# Altium project R01L_F.PrjPCB (part 3 of 3)

## Sheet 52_MIPI_Panel.SchDoc: R01L_F
size A3; DocumentNumber: Kang jin; Revision: 1.0; SheetNumber: 18; SheetTotal: 23
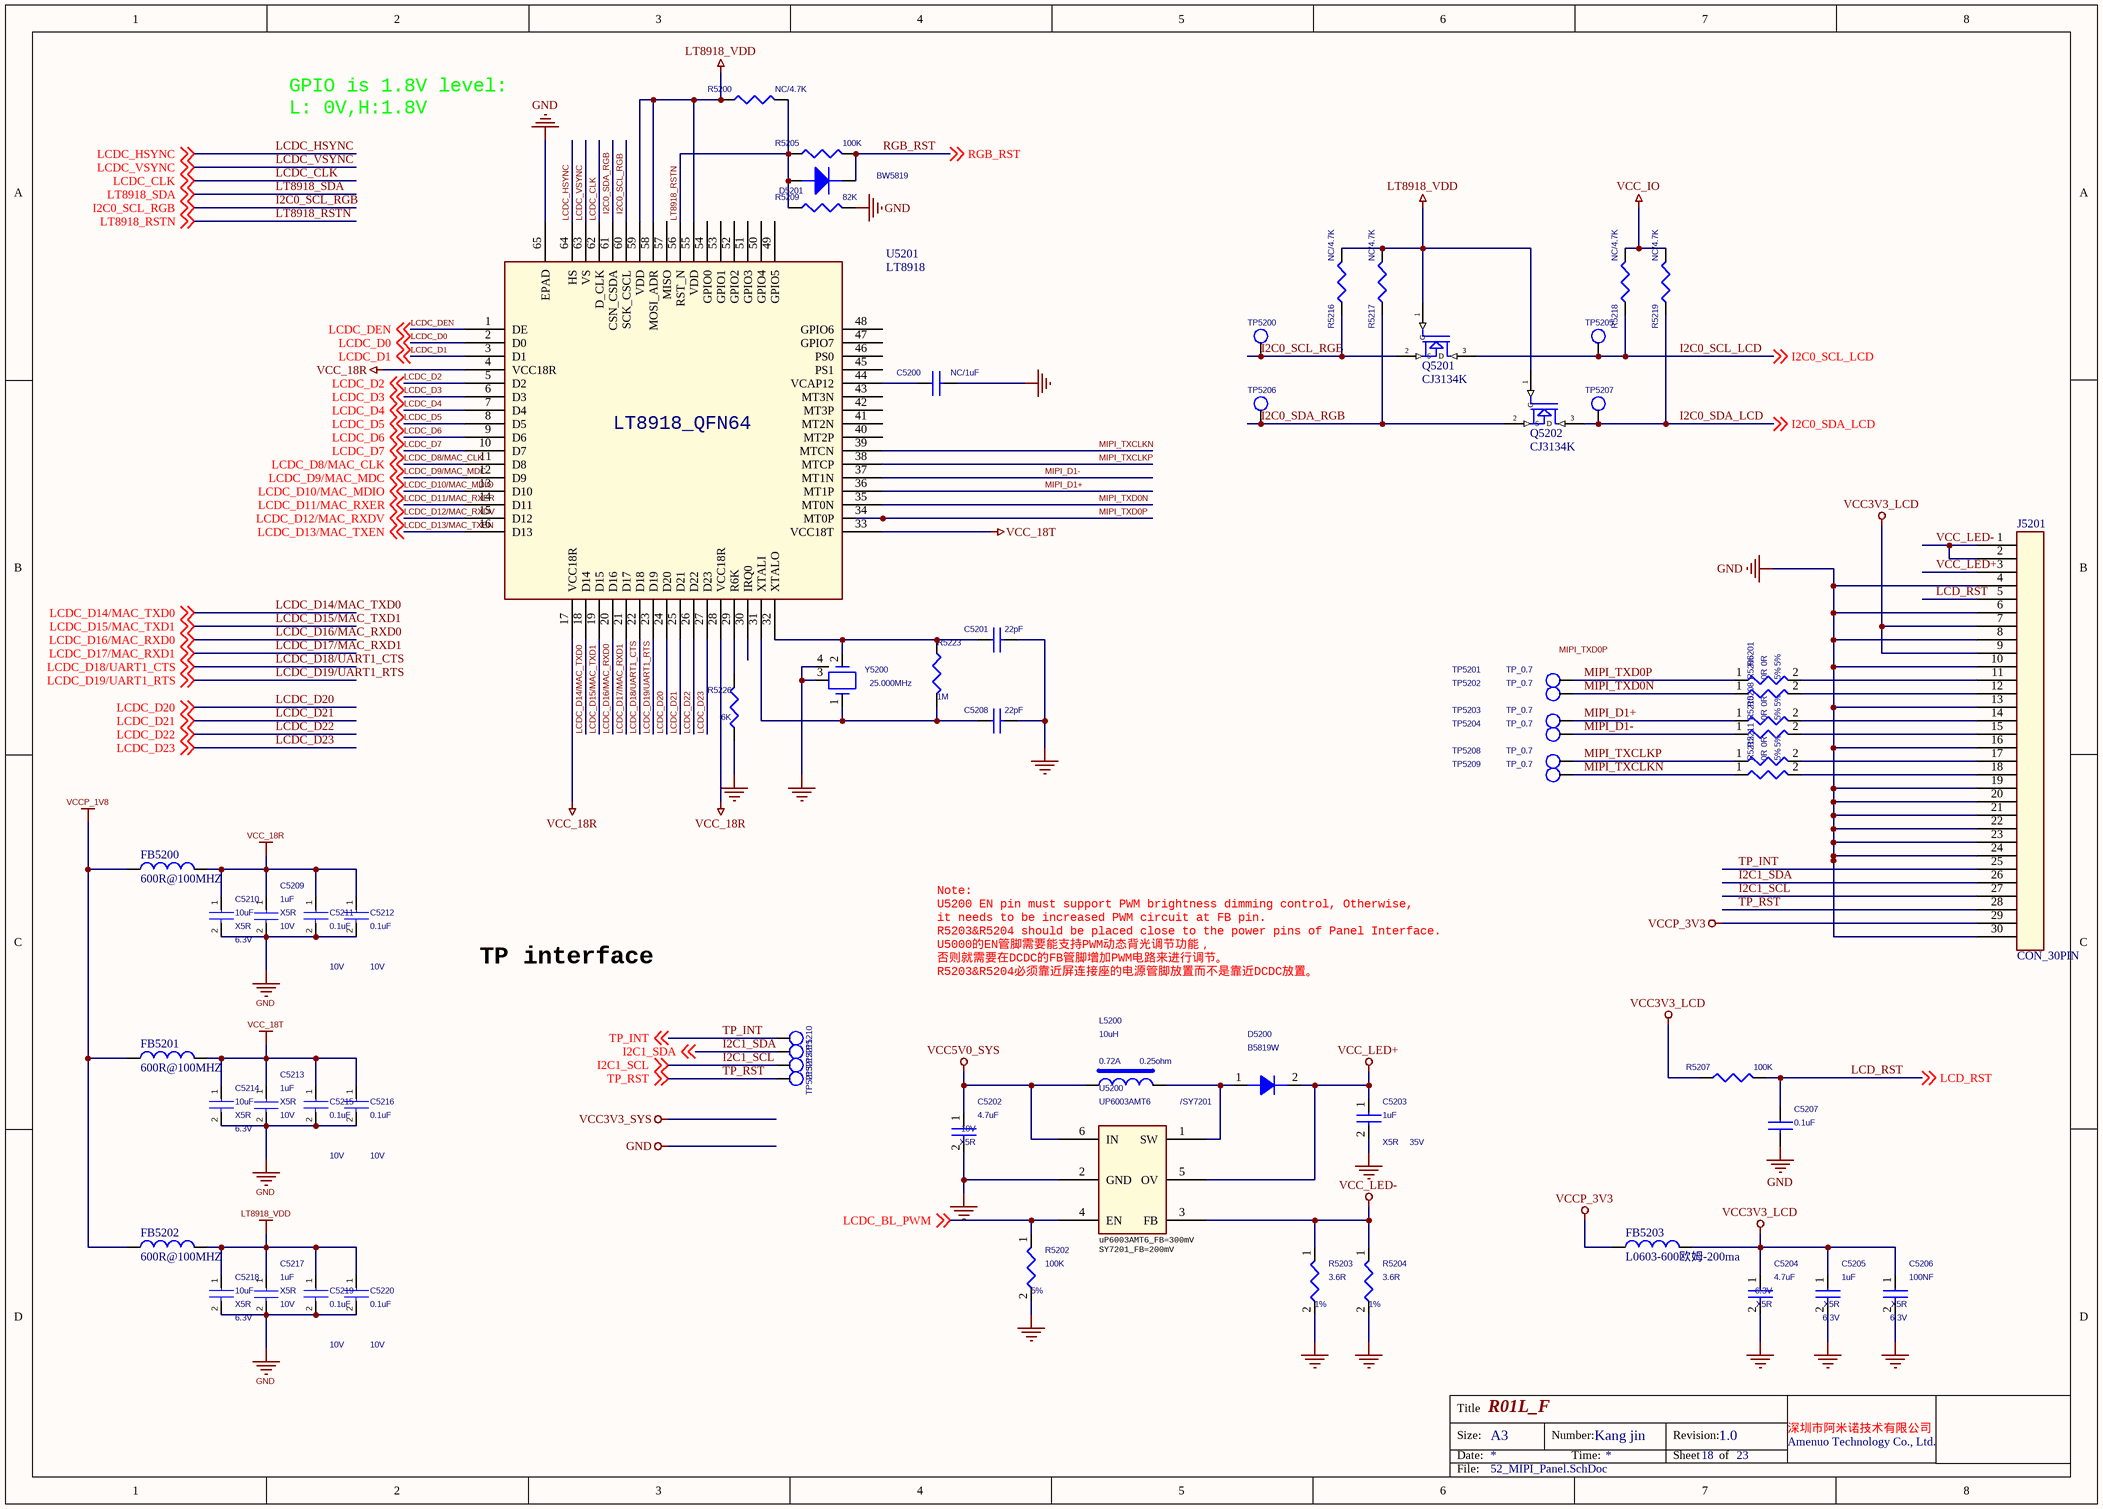
[diagram p29: 52_MIPI_Panel.SchDoc]

### Parts
C5200  NC/1uF  [C0402]
C5201  22pF  [C0402]
C5202  4.7uF  Voltage: 10V  Dielectric: X5R  [C0603]
C5203  1uF  Voltage: 35V  Dielectric: X5R  [C0402]
C5204  4.7uF  Voltage: 6.3V  Dielectric: X5R  [C0402]
C5205  1uF  Voltage: 6.3V  Dielectric: X5R  [C0402]
C5206  100NF  Voltage: 6.3V  Dielectric: X5R  [C0402]
C5207  0.1uF  [C0402]
C5208  22pF  [C0402]
C5209  value 1uF  Voltage: 10V  Dielectric: X5R  [C0402]  (hidden comment: CAP_NP_2)
C5210  value 10uF  Dielectric: X5R  Voltage: 6.3V  [C0603]  (hidden comment: CAP_NP_2)
C5211  value 0.1uF  Voltage: 10V  [C0402]  (hidden comment: CAP_NP_2)
C5212  value 0.1uF  Voltage: 10V  [C0402]  (hidden comment: CAP_NP_2)
C5213  value 1uF  Voltage: 10V  Dielectric: X5R  [C0402]  (hidden comment: CAP_NP_2)
C5214  value 10uF  Dielectric: X5R  Voltage: 6.3V  [C0603]  (hidden comment: CAP_NP_2)
C5215  value 0.1uF  Voltage: 10V  [C0402]  (hidden comment: CAP_NP_2)
C5216  value 0.1uF  Voltage: 10V  [C0402]  (hidden comment: CAP_NP_2)
C5217  value 1uF  Voltage: 10V  Dielectric: X5R  [C0402]  (hidden comment: CAP_NP_2)
C5218  value 10uF  Dielectric: X5R  Voltage: 6.3V  [C0603]  (hidden comment: CAP_NP_2)
C5219  value 0.1uF  Voltage: 10V  [C0402]  (hidden comment: CAP_NP_2)
C5220  value 0.1uF  Voltage: 10V  [C0402]  (hidden comment: CAP_NP_2)
D5200  B5819W  [SOD123]
D5201  BW5819  [SOD-323]
FB5200  600R@100MHZ  [L0402]
FB5201  600R@100MHZ  [L0402]
FB5202  600R@100MHZ  [L0402]
FB5203  L0603-600欧姆-200ma  [L0402]
J5201  CON_30PIN  [X05A10H30G]
L5200  10uH  DC Resistor: 0.25ohm  Isat: 0.72A  [IND-3X3]
Q5201  CJ3134K  [SOT23]
Q5202  CJ3134K  [SOT23]
R5200  NC/4.7K  [R0402]
R5201  0R  Tolerance: 5%  [R0402]
R5202  100K  Tolerance: 5%  [R0402]
R5203  3.6R  Tolerance: 1%  [R0402]
R5204  3.6R  Tolerance: 1%  [R0402]
R5205  100K  [R0402]
R5206  0R  Tolerance: 5%  [R0402]
R5207  100K  [R0402]
R5208  0R  Tolerance: 5%  [R0402]
R5209  82K  [R0402]
R5210  0R  Tolerance: 5%  [R0402]
R5211  0R  Tolerance: 5%  [R0402]
R5212  0R  Tolerance: 5%  [R0402]
R5216  NC/4.7K  [R0402]
R5217  NC/4.7K  [R0402]
R5218  NC/4.7K  [R0402]
R5219  NC/4.7K  [R0402]
R5223  1M  [R0402]
R5226  6K  [R0402]
TP5200  TP_0.7  [TEST]  (value not drawn)
TP5201  TP_0.7  [TP]
TP5202  TP_0.7  [TP]
TP5203  TP_0.7  [TP]
TP5204  TP_0.7  [TP]
TP5205  TP_0.7  [TEST]  (value not drawn)
TP5206  TP_0.7  [TEST]  (value not drawn)
TP5207  TP_0.7  [TEST]  (value not drawn)
TP5208  TP_0.7  [TP]
TP5209  TP_0.7  [TP]
TP5210  TP_0.7  [TEST]  (value not drawn)
TP5211  TP_0.7  [TEST]  (value not drawn)
TP5212  TP_0.7  [TEST]  (value not drawn)
TP5213  TP_0.7  [TEST]  (value not drawn)
U5200  UP6003AMT6  Option: /SY7201  [SOT-23-6]
U5201  LT8918  [LT8918_QFN64_EPAD]
Y5200  25.000MHz  [SMD_3225]

### Nets
GND: C5200.2 C5201.2 C5202.2 C5203.2 C5204.2 C5205.2 C5206.2 C5207.2 C5208.2 C5209.2 C5210.2 C5211.2 C5212.2 C5213.2 C5214.2 C5215.2 C5216.2 C5217.2 C5218.2 C5219.2 C5220.2 J5201.4 J5201.6 J5201.8 J5201.10 J5201.13 J5201.16 J5201.19 J5201.20 J5201.21 J5201.22 J5201.23 J5201.24 J5201.30 R5202.2 R5203.2 R5204.2 R5209.2 R5226.1 U5200.2(GND) U5201.65(EPAD) Y5200.3 Y5200.4
LT8918_VDD: C5217.1 C5218.1 C5219.1 C5220.1 FB5202.2 Q5201.1(G) Q5202.1(G) R5200.1 R5216.2 R5217.2 U5201.55(VDD) U5201.58(MOSI_ADR) U5201.59(VDD)
VCC3V3_LCD: C5204.1 C5205.1 C5206.1 FB5203.2 J5201.7 J5201.9 R5207.1
VCC5V0_SYS: C5202.1 L5200.1 U5200.6(IN)
VCC_18R: C5209.1 C5210.1 C5211.1 C5212.1 FB5200.2 U5201.4(VCC18R) U5201.17(VCC18R) U5201.28(VCC18R)
VCC_18T: C5213.1 C5214.1 C5215.1 C5216.1 FB5201.2 U5201.33(VCC18T)
VCC_IO: R5218.2 R5219.2
VCC_LED+: C5203.1 D5200.2(K) J5201.3 U5200.5(OV)
VCC_LED-: J5201.1 J5201.2 R5203.1 R5204.1 U5200.3(FB)
VCCP_1V8: FB5200.1 FB5201.1 FB5202.1
VCCP_3V3: FB5203.1 J5201.29
I2C0_SCL_LCD: Q5201.3(D) R5218.1 TP5205.1 ; off-sheet I2C0_SCL_LCD
I2C0_SCL_RGB: Q5201.2(S) R5216.1 TP5200.1 U5201.60(SCK_CSCL) ; off-sheet I2C0_SCL_RGB
I2C0_SDA_LCD: Q5202.3(D) R5219.1 TP5207.1 ; off-sheet I2C0_SDA_LCD
I2C0_SDA_RGB: Q5202.2(S) R5217.1 TP5206.1 U5201.61(CSN_CSDA)
I2C1_SCL: J5201.27 TP5212.1 ; off-sheet I2C1_SCL
I2C1_SDA: J5201.26 TP5211.1 ; off-sheet I2C1_SDA
LCD_RST: C5207.1 J5201.5 R5207.2 ; off-sheet LCD_RST
LCDC_BL_PWM: R5202.1 U5200.4(EN) ; off-sheet LCDC_BL_PWM
LCDC_CLK: U5201.62(D_CLK) ; off-sheet LCDC_CLK
LCDC_D0: U5201.2(D0) ; off-sheet LCDC_D0
LCDC_D1: U5201.3(D1) ; off-sheet LCDC_D1
LCDC_D2: U5201.5(D2) ; off-sheet LCDC_D2
LCDC_D3: U5201.6(D3) ; off-sheet LCDC_D3
LCDC_D4: U5201.7(D4) ; off-sheet LCDC_D4
LCDC_D5: U5201.8(D5) ; off-sheet LCDC_D5
LCDC_D6: U5201.9(D6) ; off-sheet LCDC_D6
LCDC_D7: U5201.10(D7) ; off-sheet LCDC_D7
LCDC_D8/MAC_CLK: U5201.11(D8) ; off-sheet LCDC_D8/MAC_CLK
LCDC_D9/MAC_MDC: U5201.12(D9) ; off-sheet LCDC_D9/MAC_MDC
LCDC_D10/MAC_MDIO: U5201.13(D10) ; off-sheet LCDC_D10/MAC_MDIO
LCDC_D11/MAC_RXER: U5201.14(D11) ; off-sheet LCDC_D11/MAC_RXER
LCDC_D12/MAC_RXDV: U5201.15(D12) ; off-sheet LCDC_D12/MAC_RXDV
LCDC_D13/MAC_TXEN: U5201.16(D13) ; off-sheet LCDC_D13/MAC_TXEN
LCDC_D14/MAC_TXD0: U5201.18(D14) ; off-sheet LCDC_D14/MAC_TXD0
LCDC_D15/MAC_TXD1: U5201.19(D15) ; off-sheet LCDC_D15/MAC_TXD1
LCDC_D16/MAC_RXD0: U5201.20(D16) ; off-sheet LCDC_D16/MAC_RXD0
LCDC_D17/MAC_RXD1: U5201.21(D17) ; off-sheet LCDC_D17/MAC_RXD1
LCDC_D18/UART1_CTS: U5201.22(D18) ; off-sheet LCDC_D18/UART1_CTS
LCDC_D19/UART1_RTS: U5201.23(D19) ; off-sheet LCDC_D19/UART1_RTS
LCDC_D20: U5201.24(D20) ; off-sheet LCDC_D20
LCDC_D21: U5201.25(D21) ; off-sheet LCDC_D21
LCDC_D22: U5201.26(D22) ; off-sheet LCDC_D22
LCDC_D23: U5201.27(D23) ; off-sheet LCDC_D23
LCDC_DEN: U5201.1(DE) ; off-sheet LCDC_DEN
LCDC_HSYNC: U5201.64(HS) ; off-sheet LCDC_HSYNC
LCDC_VSYNC: U5201.63(VS) ; off-sheet LCDC_VSYNC
LT8918_RSTN: D5201.1(+) R5200.2 R5205.1 R5209.1 U5201.56(RST_N) ; off-sheet LT8918_RSTN
LT8918_SDA: off-sheet LT8918_SDA
MIPI_D1+: R5208.1 TP5203.1 U5201.36(MT1P)
MIPI_D1-: R5210.1 TP5204.1 U5201.37(MT1N)
MIPI_TXCLKN: R5212.1 TP5209.1 U5201.39(MTCN)
MIPI_TXCLKP: R5211.1 TP5208.1 U5201.38(MTCP)
MIPI_TXD0N: R5206.1 TP5202.1 U5201.35(MT0N)
MIPI_TXD0P: R5201.1 TP5201.1 U5201.34(MT0P)
RGB_RST: D5201.2(-) R5205.2 ; off-sheet RGB_RST
TP_INT: J5201.25 TP5210.1 ; off-sheet TP_INT
TP_RST: J5201.28 TP5213.1 ; off-sheet TP_RST
NetC5200_1: C5200.1 U5201.44(VCAP12)
NetC5201_1: C5201.1 R5223.1 U5201.32(XTALO) Y5200.2
NetC5208_1: C5208.1 R5223.2 U5201.31(XTALI) Y5200.1
NetD5200_1: D5200.1(A) L5200.2 U5200.1(SW)
NetJ5201_11: J5201.11 R5201.2
NetJ5201_12: J5201.12 R5206.2
NetJ5201_14: J5201.14 R5208.2
NetJ5201_15: J5201.15 R5210.2
NetJ5201_17: J5201.17 R5211.2
NetJ5201_18: J5201.18 R5212.2
NetR5226_2: R5226.2 U5201.29(R6K)

Not connected (* = marked no-connect by the designer): U5201 30(IRQ0) 40(MT2P) 41(MT2N) 42(MT3P) 43(MT3N) 45(PS1) 46(PS0) 47(GPIO7) 48(GPIO6) 49(GPIO5) 50(GPIO4) 51(GPIO3) 52(GPIO2) 53(GPIO1) 54(GPIO0) 57(MISO)

### Notes on the sheet
- GPIO is 1.8V level:
  L: 0V,H:1.8V
- TP interface
- Note:
  U5200 EN pin must support PWM brightness dimming control, Otherwise,
  it needs to be increased PWM circuit at FB pin.
  R5203&R5204 should be placed close to the power pins of Panel Interface.
  U5000的EN管脚需要能支持PWM动态背光调节功能，
  否则就需要在DCDC的FB管脚增加PWM电路来进行调节。
  R5203&R5204必须靠近屏连接座的电源管脚放置而不是靠近DCDC放置。
- (near U5200) uP6003AMT6_FB=300mV
  SY7201_FB=200mV
- Labels drawn without touching a wire or pin: MIPI_TXD0P
- Title
- Size:
- Date:
- A3
- Number:
- Time:
- Revision:
- Sheet
- of
- 深圳市阿米诺技术有限公司
- Amenuo Technology Co., Ltd.
- File:
- (in symbol LT8918) LT8918_QFN64

### Library data of the parts
C5200 = CAP_NP0603: Designer: Hujin; Create Date: 20130122; Part Type: CAPACITOR; Part Number: 117-00-3040
C5201 C5208 = CAP_NP0603_Dup1: Designer: Hujin; Create Date: 20130122; Part Number: 117-00-3002
C5202 = CAP NP_Dup1: cap,4.70uF,+/-10%,10V,X5R,C0603; Manufacturer PN: C1608X5R1A475K080AC; Manufacturer: TDK; Tolerance: 10%; Priority: A; Created by: JJJ; Part Type: C0603; RK PN: C1608X5R1A475K080AC
C5203 = CAP NP_Dup1: cap,1.00uF,+/-10%,35V,X5R,C0402; Manufacturer PN: C1005X5R1V105K050BC; Manufacturer: TDK; Tolerance: 10%; Priority: A; Created by: JJJ; Part Type: C0402; RK PN: C1005X5R1V105K050BC
C5204 = CAP NP_Dup1: cap,4.70uF,+/-10%,6.3V,X5R,C0402; Manufacturer: TDK; RK PN: C1005X5R0J475K050BC; Priority: A; Tolerance: 10%; Part Type: C0402; Manufacturer PN: C1005X5R0J475K050BC; Created by: JJJ
C5205 = CAP NP_Dup1: cap,1.00uF,+/-10%,6.3V,X5R,C0402; Manufacturer PN: C1005X5R0J105K050BB; Manufacturer: TDK; Tolerance: 10%; Priority: A; Created by: JJJ; Part Type: C0402; RK PN: C1005X5R0J105K050BB
C5206 = CAP NP_Dup1: cap,100.00nF,+/-10%,6.3V,X5R,C0402; Manufacturer PN: C1005X5R0J104K050BA; Manufacturer: TDK; Tolerance: 10%; Priority: A; Created by: JJJ; Part Type: C0402; RK PN: C1005X5R0J104K050BA
C5207 = CAP NP_Dup1: 贴片电容
C5209 C5213 C5217 = CAP_NP_2: cap,1.00uF,+/-10%,10V,X5R,C0402; Manufacturer_PN: C1005X5R1A105K050BB; Manufacturer: TDK; Created_by: JJJ; Tolerance: 10%; C_Voltage: 6.3V; Priority: A; Source_Path: Z:\RK_STANDARD_LIBRARY\CADENCE_CIS\RK_DISCRETE.OLB; PCB DECAL: C0402; Part_Type: C0402; RK_PN: C1005X5R1A105K050BB
C5210 C5214 C5218 = CAP_NP_2: cap,10.00uF,+/-10%,6.3V,X5R,C0603; Manufacturer: TDK; RK_PN: C1608X5R0J106K080AB; Priority: A; Tolerance: 10%; Created_by: JJJ; Source_Path: Z:\RK_STANDARD_LIBRARY\CADENCE_CIS\RK_DISCRETE.OLB; Number: 1; PCB DECAL: C0603; Part_Type: C0603; Manufacturer_PN: C1608X5R0J106K080AB
C5211 C5212 C5215 C5216 C5219 C5220 = CAP_NP_2: cap,0.1uF,+/-10%,10V,X5R,C0402; Manufacturer: TDK; RK_PN: C1005X5R1A105K050BB; Priority: A; C_Voltage: 6.3V; Tolerance: 10%; Created_by: JJJ; Source_Path: Z:\RK_STANDARD_LIBRARY\CADENCE_CIS\RK_DISCRETE.OLB; Part_Type: C0402; Dielectric: X5R; Manufacturer_PN: C1005X5R1A105K050BB; PCB DECAL: C0402
D5200 = DIODE_Dup1: Schottky Barrier，B5819W SOD-123; Manufacturer: 长电; Priority: A; RK PN: B5819W; Part Type: Schottky rectifier; Manufacturer PN: B5819W; Created by: JJJ
D5201 = DIODE: Diode DO-214AA SMA; Manufacturer: Diodes; Manufacturer Part Number: B220/A; Part Number: TY01100606; PN: ss34; Vendor: Rohm; Part Type: Diode
FB5200-FB5202 = INDUCTOR: 磁珠;600R@100MHZ;0.34R;0.45A;0402;贴片;
FB5203 = INDUCTOR: L0603-0欧姆-1A
L5200 = INDUCTORS OF FERRITE: Power Inductor,10uH,0.2,IND_303015; Manufacturer PN: SWPA3015S100MT; Manufacturer: sunlord; Resonace frequency: 41M; Irms: 0.77A; Tolerance: 20%; Priority: A; Created by: YTL; Part Type: POWER_IND; RK PN: SWPA3015S100MT
Q5201 Q5202 = MOSFET-2S3D
R5200 R5205 R5207 R5209 R5216-R5219 = RESISTOR_1: 贴片电阻; ROOM: USB+5V; MARK: 51K
R5201 R5206 R5208 R5210-R5212 = RESISTOR_Dup1: 通用厚膜电阻,0R,+/-5%,R0402,1/16W.; Manufacturer PN: RC0402JR-0727KL; Manufacturer: YAGEO; Wattage: 1/16W; Priority: A; RK PN: RC0402JR-0R; Created by: YTL; Part Type: 通用厚膜电阻
R5202 = RESISTOR_Dup1: 通用厚膜电阻,100K,+/-5%,R0402,1/16W.; Manufacturer PN: RC0402JR-07100KL; Manufacturer: YAGEO; Wattage: 1/16W; Priority: A; Created by: YTL; Part Type: 通用厚膜电阻; RK PN: RC0402JR-07100KL
R5203 = RESISTOR_Dup1: 通用厚膜电阻,3R6,+/-1%,R0603,1/10W.; Manufacturer: YAGEO; RK PN: RC0603FR-073R6L; Priority: A; Wattage: 1/10W; Part Type: 通用厚膜电阻; Manufacturer PN: RC0603FR-073R6L; Created by: YTL
R5204 = RESISTOR_Dup1: 通用厚膜电阻,3R6,+/-1%,R0603,1/10W.; Manufacturer PN: RC0603FR-073R6L; Manufacturer: YAGEO; Wattage: 1/10W; Priority: A; Created by: YTL; Part Type: 通用厚膜电阻; RK PN: RC0603FR-073R6L
R5223 = RES0603_Dup3: Designer: Hujin; Create Date: 20130124; Part Number: 737-00-3074
R5226 = RES0603_Dup2: Designer: Hujin; Purchase Information: 13510796878 伊美尔电子; Standard PCB Footprint: 0603; PCB Footprint Status: Checked; Tolerance: %5; Create Date: 20130124; Part Status: On Hand; Price: 0.0028; Part Type: RESISTOR; Part Number: 737-00-3049
TP5200 TP5205-TP5207 TP5210-TP5213 = TP: Test Point 0.7mm; RK PN: TESTPOINT_0R7; Priority: A; Part Type: TP; Created by: JJJ
TP5201-TP5204 TP5208 TP5209 = TP: Priority: A; RK PN: TESTPOINT_0R7; Created by: JJJ; Part Type: TP
U5200 = DCDC_MP1488: Tiny Package, High Performance, Constant Current Switching Regulator for 10X White LED; Manufacturer: UPI(力智电子); Priority: A; Created by: JJJ; Manufacturer PN: UP6003AMT6; Part Type: DCDC; RK PN: UP6003AMT6
Y5200 = CRYSTAL_0: pin to pad: 2>3 3>2

## Sheet 60_WIFI_RTL8723DS.SchDoc: R01L_F
size A4
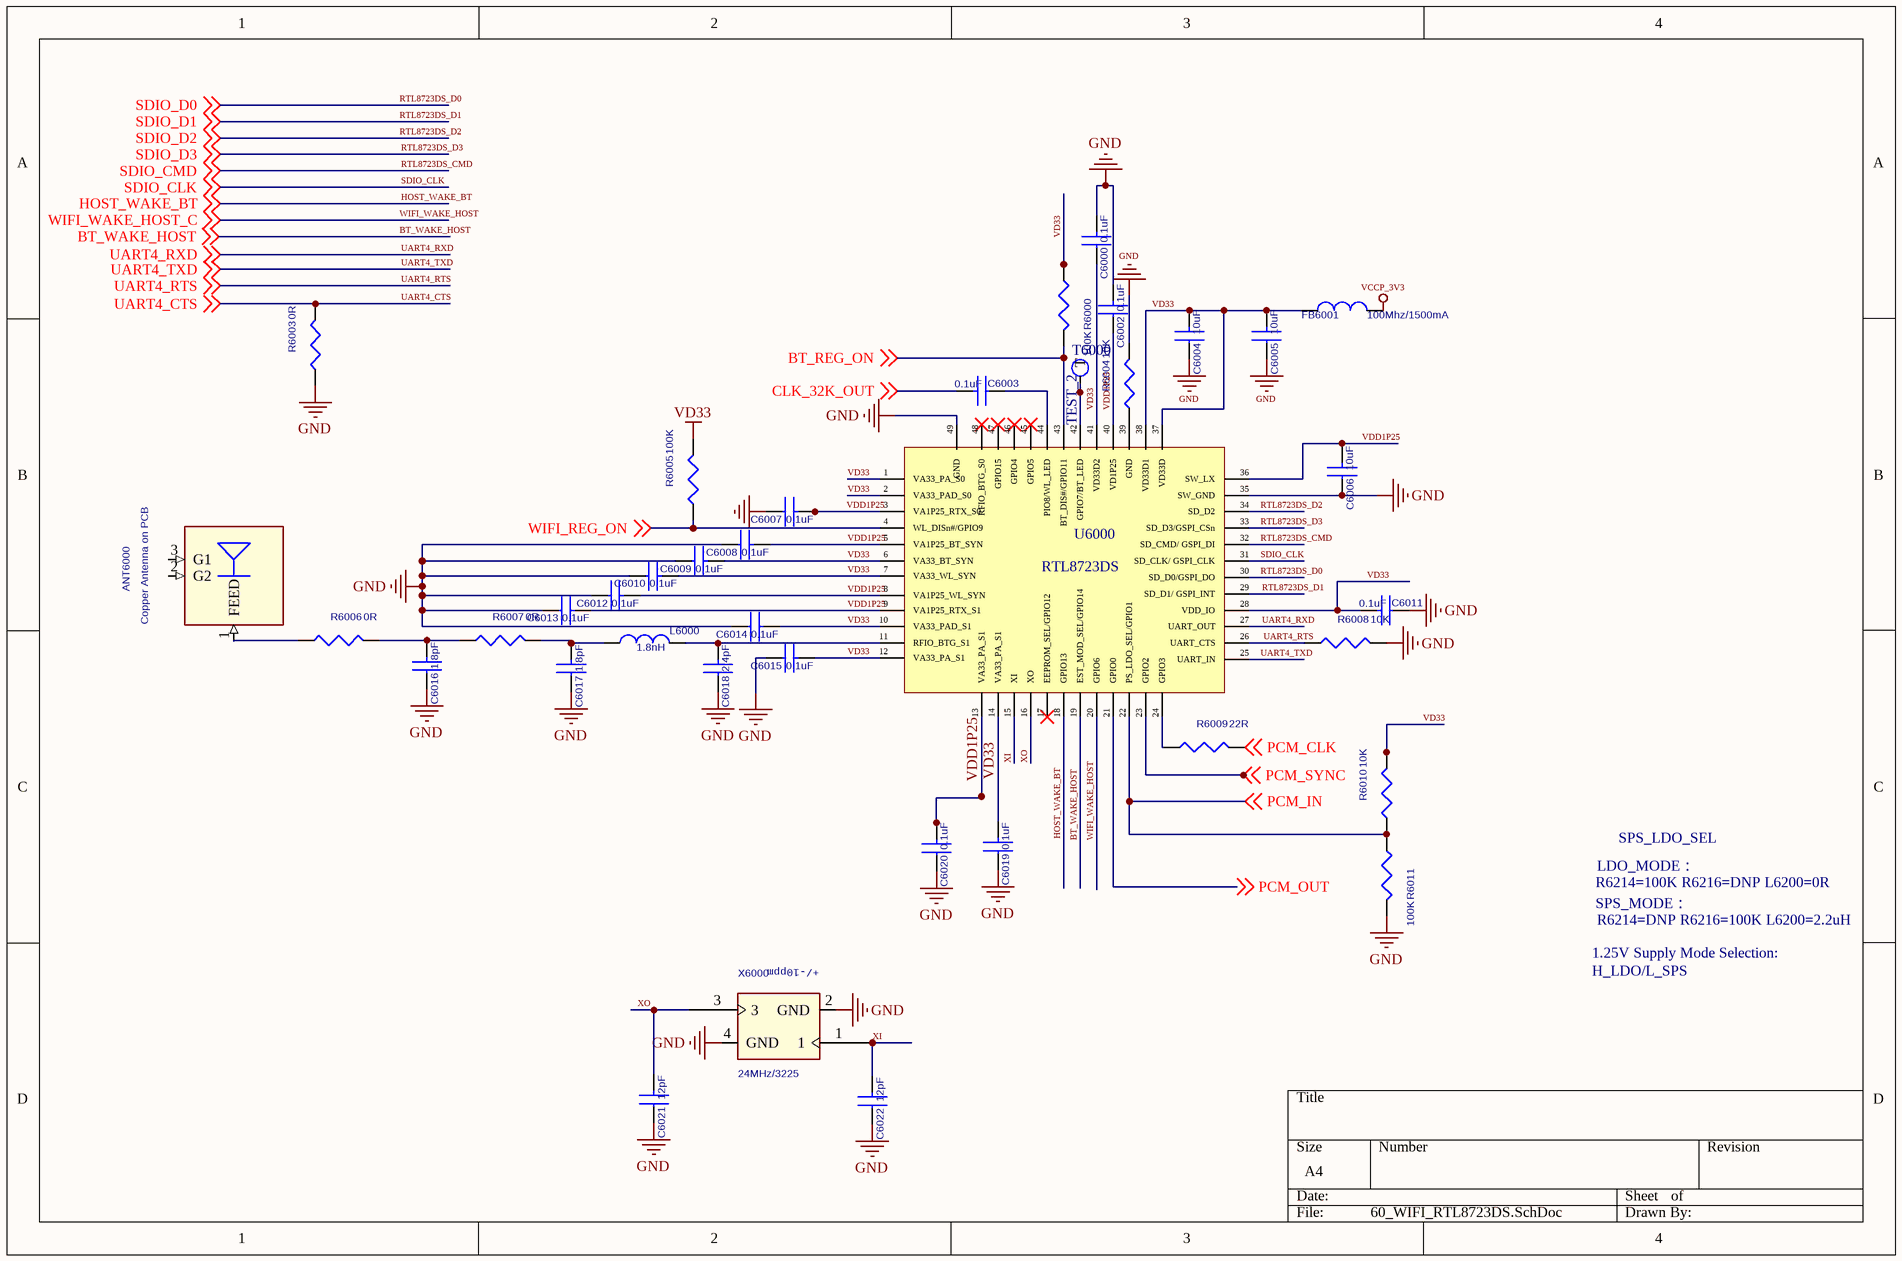
[diagram p30: 60_WIFI_RTL8723DS.SchDoc]

### Parts
ANT6000  NOTE: Copper Antenna on PCB  [ANT]  (hidden comment: N/A)
C6000  0.1uF  [C0402]
C6002  0.1uF  [C0402]
C6003  0.1uF  [C0402]
C6004  10uF  [C0603]
C6005  10uF  [C0603]
C6006  10uF  [C0603]
C6007  0.1uF  [C0402]
C6008  0.1uF  [C0402]
C6009  0.1uF  [C0402]
C6010  0.1uF  [C0402]
C6011  0.1uF  [C0402]
C6012  0.1uF  [C0402]
C6013  0.1uF  [C0402]
C6014  0.1uF  [C0402]
C6015  0.1uF  [C0402]
C6016  1.8pF  [C0402]
C6017  1.8pF  [C0402]
C6018  2.4pF  [C0402]
C6019  0.1uF  [C0402]
C6020  0.1uF  [C0402]
C6021  12pF  [C0402]
C6022  12pF  [C0402]
FB6001  100Mhz/1500mA  [L0603]
L6000  1.8nH  [R0402]
R6000  100K  [R0402]
R6003  0R  [R0402]
R6004  10K  [R0402]
R6005  100K  [R0402]
R6006  0R  [R0402]
R6007  0R  [R0402]
R6008  10K  [R0402]
R6009  22R  [R0402]
R6010  10K  [R0402]
R6011  100K  [R0402]
T6000  TEST_2  [TEST]
U6000  RTL8723DS  [RTL8723DS]
X6000  24MHz/3225  [CRY-D3225]

### Nets
GND: C6000.2 C6002.2 C6004.1 C6005.1 C6006.1 C6007.1 C6008.1 C6009.1 C6010.1 C6011.1 C6012.1 C6013.1 C6014.1 C6015.1 C6016.1 C6017.1 C6018.1 C6019.1 C6020.1 C6021.1 C6022.1 R6003.1 R6004.2 R6008.2 R6011.2 U6000.35(SW_GND) U6000.49(GND) X6000.2(GND) X6000.4(GND)
VCCP_3V3: FB6001.2
VD33: C6000.1 C6004.2 C6005.2 C6009.2 C6010.2 C6011.2 C6014.2 C6015.2 C6019.2 FB6001.1 R6000.1 R6005.2 R6010.2 U6000.1(VA33_PA_S0) U6000.2(VA33_PAD_S0) U6000.6(VA33_BT_SYN) U6000.7(VA33_WL_SYN) U6000.10(VA33_PAD_S1) U6000.12(VA33_PA_S1) U6000.14(VA33_PA_S1) U6000.28(VDD_IO) U6000.37(VD33D) U6000.38(VD33D1) U6000.41(VD33D2)
BT_REG_ON: R6000.2 U6000.43(BT_DIS#/GPIO11) ; off-sheet BT_REG_ON
BT_WAKE_HOST: U6000.19(EST_MOD_SEL/GPIO14) ; off-sheet BT_WAKE_HOST
CLK_32K_OUT: C6003.2 ; off-sheet CLK_32K_OUT
HOST_WAKE_BT: U6000.18(GPIO13) ; off-sheet HOST_WAKE_BT
PCM_CLK: R6009.2 ; off-sheet PCM_CLK
PCM_IN: R6010.1 R6011.1 U6000.22(PS_LDO_SEL/GPIO1) ; off-sheet PCM_IN
PCM_OUT: U6000.21(GPIO0) ; off-sheet PCM_OUT
PCM_SYNC: U6000.23(GPIO2) ; off-sheet PCM_SYNC
RTL8723DS_CMD: U6000.32(SD_CMD/_GSPI_DI) ; off-sheet SDIO_CMD  [also labelled SDIO_CMD]
RTL8723DS_D0: U6000.30(SD_D0/GSPI_DO) ; off-sheet SDIO_D0  [also labelled SDIO_D0]
RTL8723DS_D1: U6000.29(SD_D1/_GSPI_INT) ; off-sheet SDIO_D1  [also labelled SDIO_D1]
RTL8723DS_D2: U6000.34(SD_D2) ; off-sheet SDIO_D2  [also labelled SDIO_D2]
RTL8723DS_D3: U6000.33(SD_D3/GSPI_CSn) ; off-sheet SDIO_D3  [also labelled SDIO_D3]
SDIO_CLK: U6000.31(SD_CLK/_GSPI_CLK) ; off-sheet SDIO_CLK
UART4_CTS: R6003.2 ; off-sheet UART4_CTS
UART4_RTS: R6008.1 U6000.26(UART_CTS) ; off-sheet UART4_RTS
UART4_RXD: U6000.27(UART_OUT) ; off-sheet UART4_RXD
UART4_TXD: U6000.25(UART_IN) ; off-sheet UART4_TXD
VDD1P25: C6002.1 C6006.2 C6007.2 C6008.2 C6012.2 C6013.2 C6020.2 U6000.3(VA1P25_RTX_S0) U6000.5(VA1P25_BT_SYN) U6000.8(VA1P25_WL_SYN) U6000.9(VA1P25_RTX_S1) U6000.13(VA33_PA_S1) U6000.36(SW_LX) U6000.40(VD1P25)
WIFI_REG_ON: R6005.1 U6000.4(WL_DISn#/GPIO9) ; off-sheet WIFI_REG_ON
WIFI_WAKE_HOST: U6000.20(GPIO6) ; off-sheet WIFI_WAKE_HOST_C  [also labelled WIFI_WAKE_HOST_C]
XI: C6022.2 U6000.15(XI) X6000.1
XO: C6021.2 U6000.16(XO) X6000.3
NetANT6000_1: ANT6000.1(FEED) R6006.1
NetC6003_1: C6003.1 U6000.44(PIO8/WL_LED)
NetC6016_2: C6016.2 R6006.2 R6007.1
NetC6017_2: C6017.2 L6000.1 R6007.2
NetC6018_2: C6018.2 L6000.2 U6000.11(RFIO_BTG_S1)
NetR6004_1: R6004.1 U6000.39(GND)
NetR6009_1: R6009.1 U6000.24(GPIO3)
NetT6000_1: T6000.1(T) U6000.42(GPIO7/BT_LED)

Not connected (* = marked no-connect by the designer): ANT6000 2(G2) 3(G1); U6000 17(EEPROM_SEL/GPIO12)* 45(GPIO5)* 46(GPIO4)* 47(GPIO15)* 48(RFIO_BTG_S0)*

### Notes on the sheet
- LDO_MODE：
- SPS_LDO_SEL
- 1.25V Supply Mode Selection:
- R6214=100K R6216=DNP L6200=0R
- SPS_MODE：
- R6214=DNP R6216=100K L6200=2.2uH
- H_LDO/L_SPS
- (in symbol XTAL/26MHz/3225) +/-10ppm

### Library data of the parts
ANT6000 = ANT_IIFA_CC2420_32mil_MIR: Manufacturer Part Number: IIFA_CC2420; Manufacturer: N/A; Part Description: ANT_IIFA_CC2420_32mil_MIR
C6000 C6002-C6022 = C/0603
FB6001 = L/0603
L6000 = L/0402
R6000 R6003-R6011 = R/0402(H)
X6000 = XTAL/26MHz/3225

## Sheet 80_TY_Zigbee.SchDoc: P30L
size A4; Organization: 六零加智能科技; Address4: www.nidone.com.cn; DocumentNumber: Kang jin; Revision: 1.0; SheetNumber: 22; SheetTotal: 23
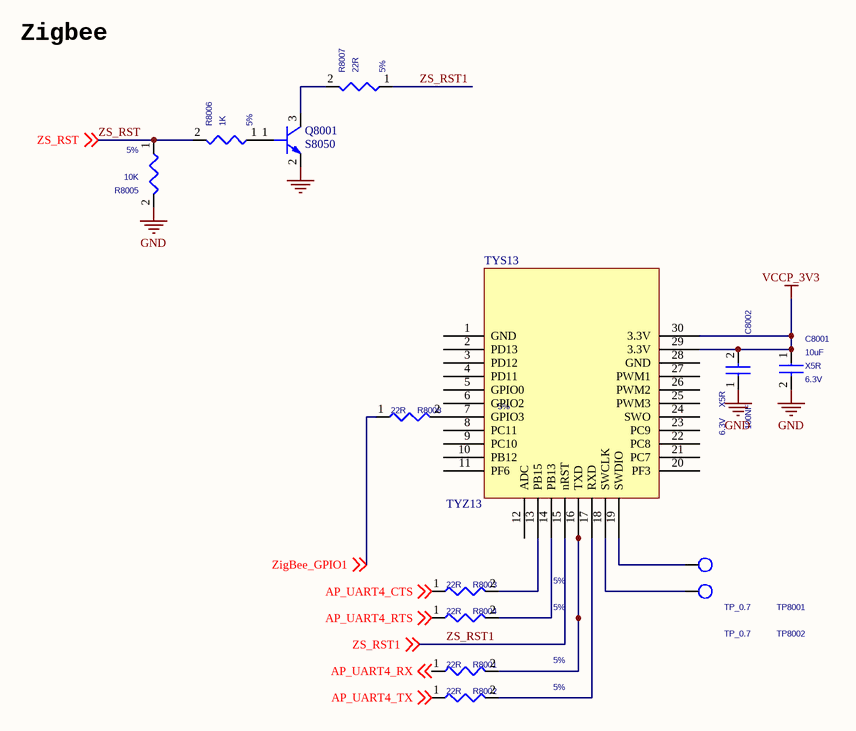
[diagram p31: 80_TY_Zigbee.SchDoc]

### Parts
C8001  10uF  Voltage: 6.3V  Dielectric: X5R  [C0603]
C8002  100NF  Voltage: 6.3V  Dielectric: X5R  [C0402]
Q8001  S8050  [SOT23]
R8001  22R  Tolerance: 5%  [R0402]
R8002  22R  Tolerance: 5%  [R0402]
R8003  22R  Tolerance: 5%  [R0402]
R8004  22R  Tolerance: 5%  [R0402]
R8005  10K  Tolerance: 5%  [R0402]
R8006  1K  Tolerance: 5%  [R0402]
R8007  22R  Tolerance: 5%  [R0402]
R8008  22R  Tolerance: 5%  [R0402]
TP8001  TP_0.7  [TEST]
TP8002  TP_0.7  [TEST]
TYS13  TYZ13  [TYS13]

### Nets
GND: C8001.2 C8002.1 Q8001.2(EMITTER) R8005.2
VCCP_3V3: C8001.1 C8002.2 TYS13.29(3.3V) TYS13.30(3.3V)
AP_UART4_CTS: R8003.1 ; off-sheet AP_UART4_CTS  [project net AP_CTS]
AP_UART4_RTS: R8004.1 ; off-sheet AP_UART4_RTS  [project net AP_RTS]
AP_UART4_RX: R8001.1 ; off-sheet AP_UART4_RX
AP_UART4_TX: R8002.1 ; off-sheet AP_UART4_TX  [project net AP_TX]
ZigBee_GPIO1: R8008.1 ; off-sheet ZigBee_GPIO1  [project net RS485_EN]
ZS_RST: R8005.1 R8006.2 ; off-sheet ZS_RST
ZS_RST1: R8007.1 TYS13.15(nRST) ; off-sheet ZS_RST1
NetQ8001_1: Q8001.1(BASE) R8006.1
NetQ8001_3: Q8001.3(COLLECTOR) R8007.2
NetR8001_2: R8001.2 TYS13.16(TXD)
NetR8002_2: R8002.2 TYS13.17(RXD)
NetR8003_2: R8003.2 TYS13.13(PB15)
NetR8004_2: R8004.2 TYS13.14(PB13)
NetR8008_2: R8008.2 TYS13.7(GPIO3)
NetTP8001_1: TP8001.1 TYS13.19(SWDIO)
NetTP8002_1: TP8002.1 TYS13.18(SWCLK)

Not connected (* = marked no-connect by the designer): TYS13 1(GND) 2(PD13) 3(PD12) 4(PD11) 5(GPIO0) 6(GPIO2) 8(PC11) 9(PC10) 10(PB12) 11(PF6) 12(ADC) 20(PF3) 21(PC7) 22(PC8) 23(PC9) 24(SWO) 25(PWM3) 26(PWM2) 27(PWM1) 28(GND)

### Notes on the sheet
- Zigbee
- Title
- Size:
- Date:
- A4
- Engineer:
- Time:
- Revision:
- Sheet
- of
- File:

### Library data of the parts
C8001 = CAP NP_Dup1: cap,10uF,+/-20%,6.3V,X5R,C0603; Manufacturer PN: C1608X5R0J106M080AC; Manufacturer: TDK; Tolerance: 20%; Priority: A; Created by: JJJ; Part Type: C0603; RK PN: C1608X5R0J106M080AC
C8002 = CAP NP_Dup1: as C5206 on sheet 52_MIPI_Panel; Created by: JJJ; Part Type: C0402; RK PN: C1005X5R0J104K050BA
Q8001 = NPN
R8001-R8004 R8008 = RESISTOR_Dup1: 通用厚膜电阻,22R,+/-5%,R0402,1/16W.; Manufacturer: YAGEO; RK PN: RC0402JR-0722RL; Priority: A; Wattage: 1/16W; Part Type: 通用厚膜电阻; Manufacturer PN: RC0402JR-0722RL; Created by: YTL
R8005 R8006 = RESISTOR_Dup1: 通用厚膜电阻,1K,+/-5%,R0402,1/16W.; Manufacturer PN: RC0402JR-072KL; Manufacturer: YAGEO; Wattage: 1/16W; Priority: A; Created by: YTL; Part Type: 通用厚膜电阻; RK PN: RC0402JR-072KL
R8007 = RESISTOR_Dup1: 通用厚膜电阻,22R,+/-5%,R0402,1/16W.; Manufacturer PN: RC0402JR-072KL; Manufacturer: YAGEO; Wattage: 1/16W; Priority: A; Created by: YTL; Part Type: 通用厚膜电阻; RK PN: RC0402JR-072KL
TP8001 TP8002 = TP: as TP5200 on sheet 52_MIPI_Panel; Part Type: TP; Created by: JJJ
TYS13 = TYZS13

## Sheet 93.SchDoc: P30L
size A4; Engineer: Kang jin; Organization: 六零加智能科技; Address4: www.nidone.com.cn; DocumentNumber: kang jin; Revision: 1.0; SheetNumber: 23; SheetTotal: 23
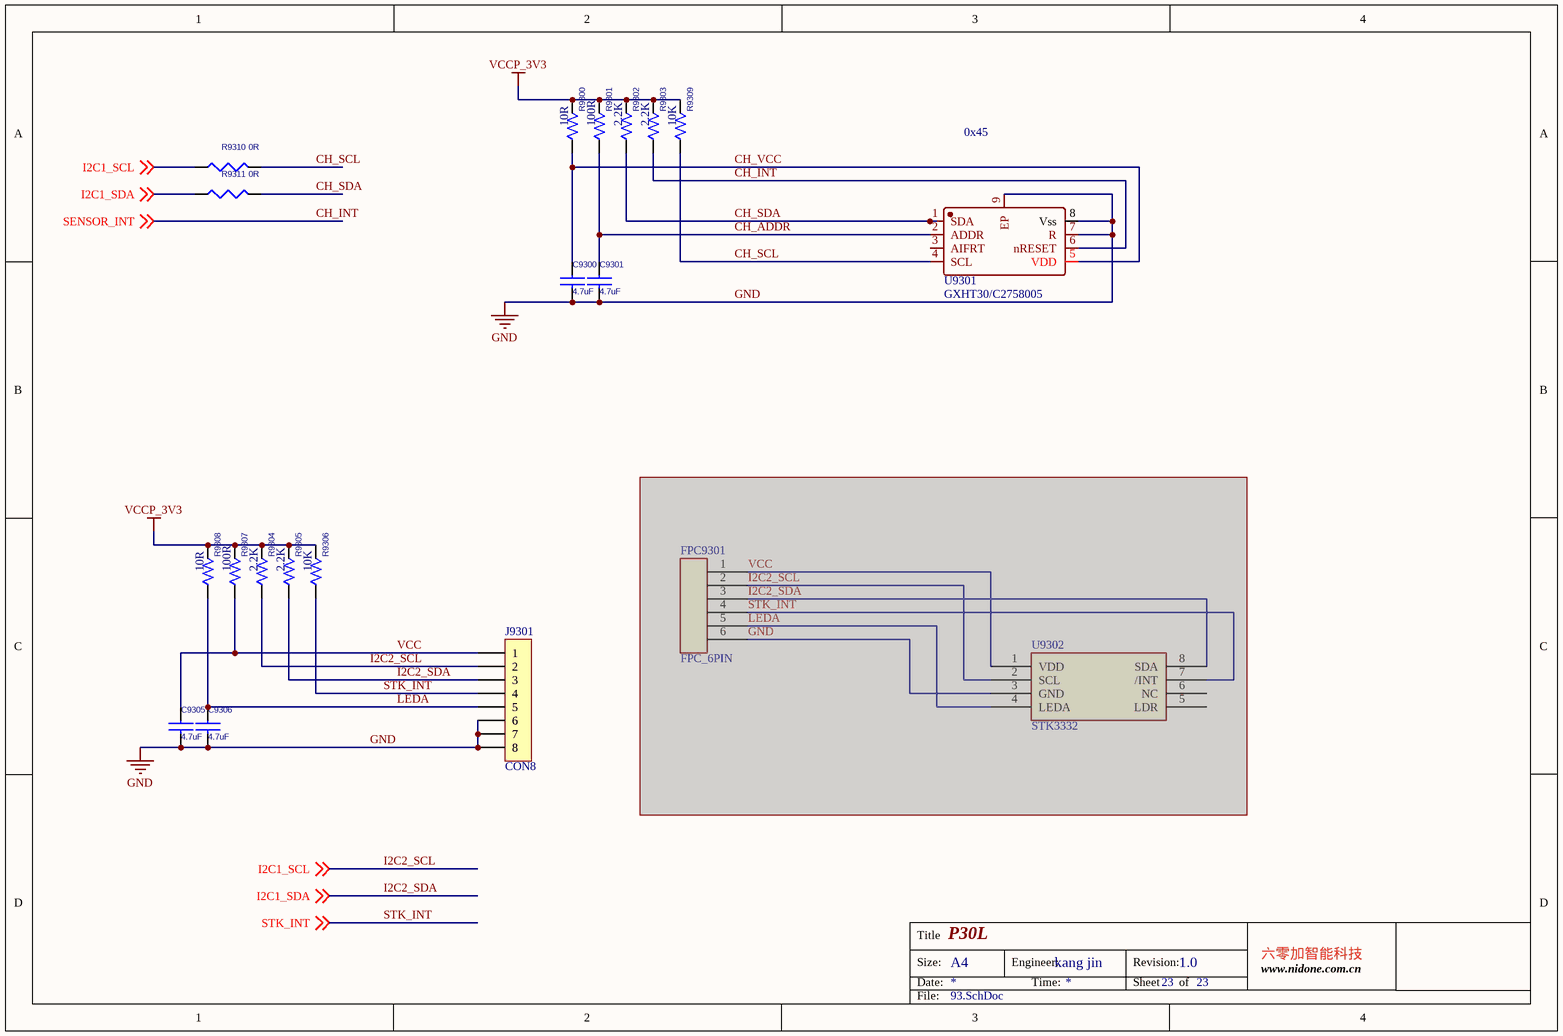
[diagram p32: 93.SchDoc]

### Parts
C9300  4.7uF  [C0402]
C9301  4.7uF  [C0402]
C9305  4.7uF  [C0402]
C9306  4.7uF  [C0402]
FPC9301  FPC_6PIN  [FPC_6Pin]  (masked out: inside a compile mask, not in the netlist)
J9301  CON8  [X05A10H06G]
R9300  10R  [R0402]
R9301  100R  [R0402]
R9302  2.2K  [R0402]
R9303  2.2K  [R0402]
R9304  2.2K  [R0402]
R9305  2.2K  [R0402]
R9306  10K  [R0402]
R9307  100R  [R0402]
R9308  10R  [R0402]
R9309  10K  [R0402]
R9310  0R  [R0402]
R9311  0R  [R0402]
U9301  GXHT30/C2758005  [DFN-8]
U9302  STK3332  [STK3332]  (masked out: inside a compile mask, not in the netlist)

### Nets
GND: C9300.2 C9301.2 C9305.2 C9306.2 J9301.6 J9301.7 J9301.8 U9301.7(R) U9301.8(Vss) U9301.9(EP)
VCCP_3V3: R9300.2 R9301.2 R9302.2 R9303.2 R9304.2 R9305.2 R9306.2 R9307.2 R9308.2 R9309.2
CH_ADDR: C9301.1 R9301.1 U9301.2(ADDR)
CH_INT: R9303.1 U9301.6(nRESET) ; off-sheet SENSOR_INT  [also labelled SENSOR_INT]
CH_SCL: R9309.1 R9310.2 U9301.4(SCL)
CH_SDA: R9302.1 R9311.2 U9301.1(SDA)
CH_VCC: C9300.1 R9300.1 U9301.5(VDD)
I2C1_SCL: J9301.2 R9304.1 R9310.1 ; off-sheet I2C1_SCL  [also labelled I2C2_SCL]
I2C1_SDA: J9301.3 R9305.1 R9311.1 ; off-sheet I2C1_SDA  [also labelled I2C2_SDA]
LEDA: C9306.1 J9301.5 R9308.1
STK_INT: J9301.4 R9306.1 ; off-sheet STK_INT
VCC: C9305.1 J9301.1 R9307.1

Not connected (* = marked no-connect by the designer): U9301 3(AIFRT)

### Notes on the sheet
- 0x45
- Title
- Size:
- Date:
- A4
- Engineer:
- Time:
- Revision:
- Sheet
- of
- File:

### Library data of the parts
C9300 C9301 C9305 C9306 = C0603
J9301 = CON8: Connector; pin to pad: 2>4 4>2 7>none 8>none
R9300 R9308 = R: ROHS CHIP RES 10R 1/16W 1%; DIST: FLAT; PSpiceTemplate: R^@REFDES %1 %2 ?TOLERANCE|R^@REFDES| @VALUE  ?TOLERANCE|\n.model R^@REFDES RES R=1 DEV=@TOLERANCE%|; VOLTAGE: RVMAX; SLOPE: RSMAX; MAX_TEMP: RTMAX; POWER: RMAX; Value: 10R
R9301 R9307 = R: ROHS CHIP RES 100R1/16W 1%; DIST: FLAT; PSpiceTemplate: R^@REFDES %1 %2 ?TOLERANCE|R^@REFDES| @VALUE  ?TOLERANCE|\n.model R^@REFDES RES R=1 DEV=@TOLERANCE%|; VOLTAGE: RVMAX; SLOPE: RSMAX; MAX_TEMP: RTMAX; POWER: RMAX; Value: 100R
R9302-R9305 = R: ROHS CHIP RES 2.2K 1/16W 1%; DIST: FLAT; PSpiceTemplate: R^@REFDES %1 %2 ?TOLERANCE|R^@REFDES| @VALUE  ?TOLERANCE|\n.model R^@REFDES RES R=1 DEV=@TOLERANCE%|; VOLTAGE: RVMAX; SLOPE: RSMAX; MAX_TEMP: RTMAX; POWER: RMAX; Value: 2.2K
R9306 R9309 = R: ROHS CHIP RES 10K 1/16W 1%; DIST: FLAT; PSpiceTemplate: R^@REFDES %1 %2 ?TOLERANCE|R^@REFDES| @VALUE  ?TOLERANCE|\n.model R^@REFDES RES R=1 DEV=@TOLERANCE%|; VOLTAGE: RVMAX; SLOPE: RSMAX; MAX_TEMP: RTMAX; POWER: RMAX; Value: 10K
R9310 R9311 = R/0402(H)
U9301 = GXHT30

## Sheet 26_RS485.SchDoc: R01L_F
size A4
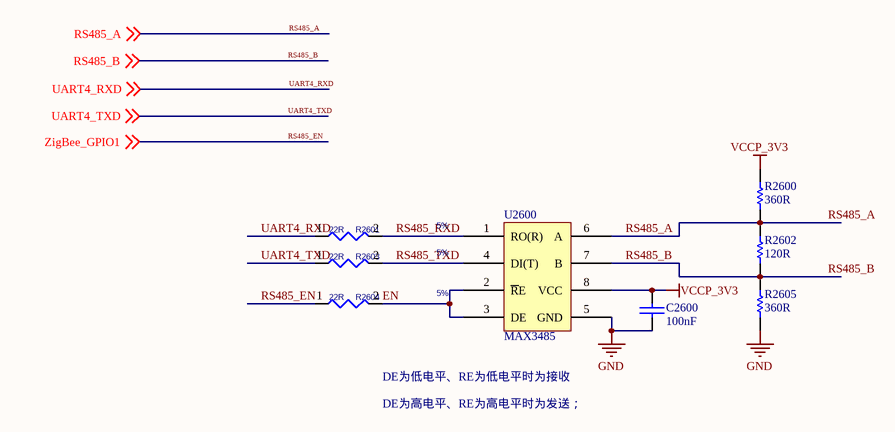
[diagram p33: 26_RS485.SchDoc]

### Parts
C2600  100nF  [C0402]
R2600  360R  [R0402]
R2601  22R  Tolerance: 5%  [R0402]
R2602  120R  [R0402]
R2603  22R  Tolerance: 5%  [R0402]
R2604  22R  Tolerance: 5%  [R0402]
R2605  360R  [R0402]
U2600  MAX3485  [MSOP-8]

### Nets
GND: C2600.1 R2605.1 U2600.5(GND)
VCCP_3V3: C2600.2 R2600.2 U2600.8(VCC)
EN: R2604.2 U2600.2(~{R}E) U2600.3(DE)
RS485_A: R2600.1 R2602.2 U2600.6(A) ; off-sheet RS485_A
RS485_B: R2602.1 R2605.2 U2600.7(B) ; off-sheet RS485_B
RS485_EN: R2604.1 ; off-sheet ZigBee_GPIO1  [also labelled ZigBee_GPIO1]
RS485_RXD: R2601.2 U2600.1(RO(R))
RS485_TXD: R2603.2 U2600.4(DI(T))
UART4_RXD: R2601.1 ; off-sheet UART4_RXD
UART4_TXD: R2603.1 ; off-sheet UART4_TXD

### Notes on the sheet
- DE为低电平、RE为低电平时为接收
- DE为高电平、RE为高电平时为发送；

### Library data of the parts
C2600 = CAP: 无极性电容
R2600 R2602 R2605 = RES
R2601 R2603 R2604 = RESISTOR_Dup1: as R8001 on sheet 80_TY_Zigbee; Part Type: 通用厚膜电阻; Manufacturer PN: RC0402JR-0722RL; Created by: YTL
U2600 = MAX485

## Nets that join several sheets
GND: 03a_POWER-DISCRETE (50 pins), 04_POWER (115 pins), 05_OSC_PLL (14 pins), 06_DDR_CONTROLLER (9 pins), 07_FLASH_CONTROLLER (C1.2), 08_USB_CONTROLLER (6 pins), 09_SARADC_OTP (6 pins), 10_LCDC_MAC_I2S1_JTAG (C24.2 C10001.2), 11_SDIO_SDMMC (C7.2 C98.2), 12_GPIO_I2S0_PDM_SPDIF (C83.2 C96.2 R16.2), 13_ACODEC (18 pins), 14_RAM-DDR3_1X16BIT (35 pins), 15_FLASH-NAND_FLASH (6 pins), 18_AUDIO_PowerAmp-AnalogT (15 pins), 25_USB_OTG (14 pins), 52_MIPI_Panel (43 pins), 60_WIFI_RTL8723DS (29 pins), 80_TY_Zigbee (C8001.2 C8002.1 Q8001.2 R8005.2), 93 (10 pins), 26_RS485 (C2600.1 R2605.1 U2600.5)
VCC5V0_SYS: 03a_POWER-DISCRETE (15 pins), 08_USB_CONTROLLER (R801.2), 18_AUDIO_PowerAmp-AnalogT (FB1801.2), 25_USB_OTG (8 pins), 52_MIPI_Panel (C5202.1 L5200.1 U5200.6)
VCC_1V8: 03a_POWER-DISCRETE (C324.1 FB300.1 U301.5), 05_OSC_PLL (FB6.2 R40.1 R100.2), 08_USB_CONTROLLER (FB4.2), 09_SARADC_OTP (7 pins), 13_ACODEC (R1301.2), 18_AUDIO_PowerAmp-AnalogT (C1800.1 R1805.1 R1806.1 U1800.5)
VCC_1V8_CODEC: 03a_POWER-DISCRETE (C334.1 FB300.2), 13_ACODEC (C102.1 C103.1 U6.M17 U6.N17)
VCC_3V3_CODEC: 03a_POWER-DISCRETE (C339.1 FB301.2), 13_ACODEC (C31.1 U6.P16)
VCC_DDR: 03a_POWER-DISCRETE (6 pins), 06_DDR_CONTROLLER (15 pins), 14_RAM-DDR3_1X16BIT (27 pins)
VCC_IO: 03a_POWER-DISCRETE (11 pins), 05_OSC_PLL (C100.1 U6.E14), 07_FLASH_CONTROLLER (C1.1 U6.R12), 08_USB_CONTROLLER (C101.1 U6.D13), 10_LCDC_MAC_I2S1_JTAG (C24.1 U6.R11), 11_SDIO_SDMMC (C7.1 C98.1 U6.D14 U6.J14), 12_GPIO_I2S0_PDM_SPDIF (5 pins), 15_FLASH-NAND_FLASH (C8.1 C95.1 U1501.8), 18_AUDIO_PowerAmp-AnalogT (C1802.1 R1802.1 U1800.1), 52_MIPI_Panel (R5218.2 R5219.2)
VCCP_1V8: 03a_POWER-DISCRETE (6 pins), 52_MIPI_Panel (FB5200.1 FB5201.1 FB5202.1)
VCCP_3V3: 03a_POWER-DISCRETE (6 pins), 52_MIPI_Panel (FB5203.1 J5201.29), 60_WIFI_RTL8723DS (FB6001.2), 80_TY_Zigbee (C8001.1 C8002.2 TYS13.29 TYS13.30), 93 (10 pins), 26_RS485 (C2600.2 R2600.2 U2600.8)
VDD_1V0: 03a_POWER-DISCRETE (C320.1 FB302.2), 05_OSC_PLL (FB5.2), 08_USB_CONTROLLER (R96.2)
VDD_CORE: 03a_POWER-DISCRETE (8 pins), 04_POWER (15 pins)
VDD_LOG: 03a_POWER-DISCRETE (8 pins), 04_POWER (9 pins)
AP_CTS: 12_GPIO_I2S0_PDM_SPDIF (U6.Y16), 80_TY_Zigbee (R8003.1)
AP_RTS: 12_GPIO_I2S0_PDM_SPDIF (U6.W16), 80_TY_Zigbee (R8004.1)
AP_TX: 12_GPIO_I2S0_PDM_SPDIF (U6.V16), 80_TY_Zigbee (R8002.1)
AP_UART4_RX: 12_GPIO_I2S0_PDM_SPDIF (U6.U14), 80_TY_Zigbee (R8001.1)
BT_REG_ON: 12_GPIO_I2S0_PDM_SPDIF (U6.T16), 60_WIFI_RTL8723DS (R6000.2 U6000.43)
BT_WAKE_HOST: 12_GPIO_I2S0_PDM_SPDIF (U6.R16), 60_WIFI_RTL8723DS (U6000.19)
CH_INT: 12_GPIO_I2S0_PDM_SPDIF (U6.Y3), 93 (R9303.1 U9301.6)
CLK_32K_OUT: 12_GPIO_I2S0_PDM_SPDIF (U6.Y2), 60_WIFI_RTL8723DS (C6003.2)
DDR_A0: 06_DDR_CONTROLLER (U6.B4), 14_RAM-DDR3_1X16BIT (U2.N3)
DDR_A1: 06_DDR_CONTROLLER (U6.A5), 14_RAM-DDR3_1X16BIT (U2.P7)
DDR_A2: 06_DDR_CONTROLLER (U6.A3), 14_RAM-DDR3_1X16BIT (U2.P3)
DDR_A3: 06_DDR_CONTROLLER (U6.E6), 14_RAM-DDR3_1X16BIT (U2.N2)
DDR_A4: 06_DDR_CONTROLLER (U6.B7), 14_RAM-DDR3_1X16BIT (U2.P8)
DDR_A5: 06_DDR_CONTROLLER (U6.B3), 14_RAM-DDR3_1X16BIT (U2.P2)
DDR_A6: 06_DDR_CONTROLLER (U6.A6), 14_RAM-DDR3_1X16BIT (U2.R8)
DDR_A7: 06_DDR_CONTROLLER (U6.A2), 14_RAM-DDR3_1X16BIT (U2.R2)
DDR_A8: 06_DDR_CONTROLLER (U6.A10), 14_RAM-DDR3_1X16BIT (U2.T8)
DDR_A9: 06_DDR_CONTROLLER (U6.E7), 14_RAM-DDR3_1X16BIT (U2.R3)
DDR_A10: 06_DDR_CONTROLLER (U6.C9), 14_RAM-DDR3_1X16BIT (U2.L7)
DDR_A11: 06_DDR_CONTROLLER (U6.B5), 14_RAM-DDR3_1X16BIT (U2.R7)
DDR_A12: 06_DDR_CONTROLLER (U6.B6), 14_RAM-DDR3_1X16BIT (U2.N7)
DDR_A13: 06_DDR_CONTROLLER (U6.D7), 14_RAM-DDR3_1X16BIT (U2.T3)
DDR_A14: 06_DDR_CONTROLLER (U6.B10), 14_RAM-DDR3_1X16BIT (U2.T7)
DDR_BA0: 06_DDR_CONTROLLER (U6.B2), 14_RAM-DDR3_1X16BIT (U2.M2)
DDR_BA1: 06_DDR_CONTROLLER (U6.C8), 14_RAM-DDR3_1X16BIT (U2.N8)
DDR_BA2: 06_DDR_CONTROLLER (U6.D6), 14_RAM-DDR3_1X16BIT (U2.M3)
DDR_CASN: 06_DDR_CONTROLLER (U6.D8), 14_RAM-DDR3_1X16BIT (U2.K3)
DDR_CKE0: 06_DDR_CONTROLLER (U6.B9), 14_RAM-DDR3_1X16BIT (U2.K9)
DDR_CLKN: 06_DDR_CONTROLLER (U6.C2), 14_RAM-DDR3_1X16BIT (R80.1 TP1402.1 U2.K7)
DDR_CLKP: 06_DDR_CONTROLLER (U6.C3), 14_RAM-DDR3_1X16BIT (R79.1 TP1401.1 U2.J7)
DDR_CS0N: 06_DDR_CONTROLLER (U6.B1), 14_RAM-DDR3_1X16BIT (U2.L2)
DDR_D0: 06_DDR_CONTROLLER (U6.J4), 14_RAM-DDR3_1X16BIT (U2.A2)
DDR_D1: 06_DDR_CONTROLLER (U6.G5), 14_RAM-DDR3_1X16BIT (U2.A3)
DDR_D2: 06_DDR_CONTROLLER (U6.H4), 14_RAM-DDR3_1X16BIT (U2.C2)
DDR_D3: 06_DDR_CONTROLLER (U6.L1), 14_RAM-DDR3_1X16BIT (U2.A7)
DDR_D4: 06_DDR_CONTROLLER (U6.E2), 14_RAM-DDR3_1X16BIT (U2.D7)
DDR_D5: 06_DDR_CONTROLLER (U6.F1), 14_RAM-DDR3_1X16BIT (U2.C3)
DDR_D6: 06_DDR_CONTROLLER (U6.E3), 14_RAM-DDR3_1X16BIT (U2.C8)
DDR_D7: 06_DDR_CONTROLLER (U6.K2), 14_RAM-DDR3_1X16BIT (U2.B8)
DDR_D8: 06_DDR_CONTROLLER (U6.F4), 14_RAM-DDR3_1X16BIT (U2.G2)
DDR_D9: 06_DDR_CONTROLLER (U6.G2), 14_RAM-DDR3_1X16BIT (U2.H7)
DDR_D10: 06_DDR_CONTROLLER (U6.L4), 14_RAM-DDR3_1X16BIT (U2.F8)
DDR_D11: 06_DDR_CONTROLLER (U6.D3), 14_RAM-DDR3_1X16BIT (U2.H3)
DDR_D12: 06_DDR_CONTROLLER (U6.L2), 14_RAM-DDR3_1X16BIT (U2.F7)
DDR_D13: 06_DDR_CONTROLLER (U6.F3), 14_RAM-DDR3_1X16BIT (U2.F2)
DDR_D14: 06_DDR_CONTROLLER (U6.M2), 14_RAM-DDR3_1X16BIT (U2.H8)
DDR_D15: 06_DDR_CONTROLLER (U6.K5), 14_RAM-DDR3_1X16BIT (U2.E3)
DDR_DM0: 06_DDR_CONTROLLER (U6.G1), 14_RAM-DDR3_1X16BIT (U2.D3)
DDR_DM1: 06_DDR_CONTROLLER (U6.L3), 14_RAM-DDR3_1X16BIT (U2.E7)
DDR_DQS0N: 06_DDR_CONTROLLER (U6.K4), 14_RAM-DDR3_1X16BIT (U2.B7)
DDR_DQS0P: 06_DDR_CONTROLLER (U6.J3), 14_RAM-DDR3_1X16BIT (U2.C7)
DDR_DQS1N: 06_DDR_CONTROLLER (U6.H3), 14_RAM-DDR3_1X16BIT (U2.G3)
DDR_DQS1P: 06_DDR_CONTROLLER (U6.H2), 14_RAM-DDR3_1X16BIT (U2.F3)
DDR_ODT0: 06_DDR_CONTROLLER (U6.C5), 14_RAM-DDR3_1X16BIT (U2.K1)
DDR_RASN: 06_DDR_CONTROLLER (U6.D5), 14_RAM-DDR3_1X16BIT (U2.J3)
DDR_RESET: 06_DDR_CONTROLLER (U6.E4), 14_RAM-DDR3_1X16BIT (C68.1 U2.T2)
DDR_WEN: 06_DDR_CONTROLLER (U6.E8), 14_RAM-DDR3_1X16BIT (U2.L3)
FLASH_D0: 07_FLASH_CONTROLLER (U6.U11), 15_FLASH-NAND_FLASH (SW1.1 TP2.1 U1501.5)
FLASH_D1: 07_FLASH_CONTROLLER (U6.V12), 15_FLASH-NAND_FLASH (U1501.2)
FLASH_D2: 07_FLASH_CONTROLLER (U6.Y12), 15_FLASH-NAND_FLASH (U1501.3)
FLASH_D3: 07_FLASH_CONTROLLER (U6.Y11), 15_FLASH-NAND_FLASH (U1501.7)
FLASH_D4/SFC_CLK: 07_FLASH_CONTROLLER (U6.W11), 15_FLASH-NAND_FLASH (TP3.1 U1501.6)
FLASH_D5/SFC_CS0: 07_FLASH_CONTROLLER (U6.V11), 15_FLASH-NAND_FLASH (U1501.1)
HOST_WAKE_BT: 12_GPIO_I2S0_PDM_SPDIF (U6.T15), 60_WIFI_RTL8723DS (U6000.18)
I2C1_SCL: 52_MIPI_Panel (J5201.27 TP5212.1), 93 (J9301.2 R9304.1 R9310.1)
I2C1_SDA: 52_MIPI_Panel (J5201.26 TP5211.1), 93 (J9301.3 R9305.1 R9311.1)
I2C3_SCL/UART3_TX: 03a_POWER-DISCRETE (R326.1), 07_FLASH_CONTROLLER (U6.T12)
LCD_RST: 12_GPIO_I2S0_PDM_SPDIF (U6.T2), 52_MIPI_Panel (C5207.1 J5201.5 R5207.2)
LCDC_BL_PWM: 12_GPIO_I2S0_PDM_SPDIF (U6.W2), 52_MIPI_Panel (R5202.1 U5200.4)
LCDC_CLK: 10_LCDC_MAC_I2S1_JTAG (C10001.1 R10001.2), 52_MIPI_Panel (U5201.62)
LCDC_D0: 10_LCDC_MAC_I2S1_JTAG (U6.W5), 52_MIPI_Panel (U5201.2)
LCDC_D1: 10_LCDC_MAC_I2S1_JTAG (U6.V5), 52_MIPI_Panel (U5201.3)
LCDC_D2: 10_LCDC_MAC_I2S1_JTAG (U6.U5), 52_MIPI_Panel (U5201.5)
LCDC_D3: 10_LCDC_MAC_I2S1_JTAG (U6.W6), 52_MIPI_Panel (U5201.6)
LCDC_D4: 10_LCDC_MAC_I2S1_JTAG (U6.V6), 52_MIPI_Panel (U5201.7)
LCDC_D5: 10_LCDC_MAC_I2S1_JTAG (U6.U6), 52_MIPI_Panel (U5201.8)
LCDC_D6: 10_LCDC_MAC_I2S1_JTAG (U6.T6), 52_MIPI_Panel (U5201.9)
LCDC_D7: 10_LCDC_MAC_I2S1_JTAG (U6.U7), 52_MIPI_Panel (U5201.10)
LCDC_D8/MAC_CLK: 10_LCDC_MAC_I2S1_JTAG (U6.V7), 52_MIPI_Panel (U5201.11)
LCDC_D9/MAC_MDC: 10_LCDC_MAC_I2S1_JTAG (U6.T8), 52_MIPI_Panel (U5201.12)
LCDC_D10/MAC_MDIO: 10_LCDC_MAC_I2S1_JTAG (U6.W7), 52_MIPI_Panel (U5201.13)
LCDC_D11/MAC_RXER: 10_LCDC_MAC_I2S1_JTAG (U6.Y7), 52_MIPI_Panel (U5201.14)
LCDC_D12/MAC_RXDV: 10_LCDC_MAC_I2S1_JTAG (U6.V9), 52_MIPI_Panel (U5201.15)
LCDC_D13/MAC_TXEN: 10_LCDC_MAC_I2S1_JTAG (U6.V8), 52_MIPI_Panel (U5201.16)
LCDC_D14/MAC_TXD0: 10_LCDC_MAC_I2S1_JTAG (U6.U8), 52_MIPI_Panel (U5201.18)
LCDC_D15/MAC_TXD1: 10_LCDC_MAC_I2S1_JTAG (U6.U9), 52_MIPI_Panel (U5201.19)
LCDC_D16/MAC_RXD0: 10_LCDC_MAC_I2S1_JTAG (U6.R9), 52_MIPI_Panel (U5201.20)
LCDC_D17/MAC_RXD1: 10_LCDC_MAC_I2S1_JTAG (U6.Y9), 52_MIPI_Panel (U5201.21)
LCDC_D18/UART1_CTS: 07_FLASH_CONTROLLER (U6.U10), 52_MIPI_Panel (U5201.22)
LCDC_D19/UART1_RTS: 07_FLASH_CONTROLLER (U6.U12), 52_MIPI_Panel (U5201.23)
LCDC_D20: 07_FLASH_CONTROLLER (U6.V13), 52_MIPI_Panel (U5201.24)
LCDC_D21: 07_FLASH_CONTROLLER (U6.T13), 52_MIPI_Panel (U5201.25)
LCDC_D22: 07_FLASH_CONTROLLER (U6.U13), 52_MIPI_Panel (U5201.26)
LCDC_D23: 07_FLASH_CONTROLLER (U6.R10), 52_MIPI_Panel (U5201.27)
LCDC_DEN: 10_LCDC_MAC_I2S1_JTAG (U6.W4), 52_MIPI_Panel (U5201.1)
LCDC_HSYNC: 10_LCDC_MAC_I2S1_JTAG (U6.V4), 52_MIPI_Panel (U5201.64)
LCDC_VSYNC: 10_LCDC_MAC_I2S1_JTAG (U6.U4), 52_MIPI_Panel (U5201.63)
LINEOUT_L: 13_ACODEC (U6.W20), 18_AUDIO_PowerAmp-AnalogT (C69.1)
MICN2: 13_ACODEC (C1302.1), 18_AUDIO_PowerAmp-AnalogT (C1804.1 R1803.1 R1804.1 TP1802.1)
MICN5: 13_ACODEC (C1304.1), 18_AUDIO_PowerAmp-AnalogT (R1809.1)
MICN7: 13_ACODEC (C1306.1), 18_AUDIO_PowerAmp-AnalogT (R1810.1)
MICP2: 13_ACODEC (C1303.1), 18_AUDIO_PowerAmp-AnalogT (C1801.2 R1800.2 R1801.2 TP1801.1)
MICP5: 13_ACODEC (C1305.1), 18_AUDIO_PowerAmp-AnalogT (R1807.1)
MICP7: 13_ACODEC (C1307.1), 18_AUDIO_PowerAmp-AnalogT (R1808.1)
PCM_CLK: 12_GPIO_I2S0_PDM_SPDIF (U6.R15), 60_WIFI_RTL8723DS (R6009.2)
PCM_IN: 12_GPIO_I2S0_PDM_SPDIF (U6.T14), 60_WIFI_RTL8723DS (R6010.1 R6011.1 U6000.22)
PCM_OUT: 12_GPIO_I2S0_PDM_SPDIF (U6.U16), 60_WIFI_RTL8723DS (U6000.21)
PCM_SYNC: 12_GPIO_I2S0_PDM_SPDIF (U6.V17), 60_WIFI_RTL8723DS (U6000.23)
RGB_RST: 12_GPIO_I2S0_PDM_SPDIF (U6.N2), 52_MIPI_Panel (D5201.2 R5205.2)
RS485_A: 25_USB_OTG (J2500.6), 26_RS485 (R2600.1 R2602.2 U2600.6)
RS485_B: 25_USB_OTG (J2500.5), 26_RS485 (R2602.1 R2605.2 U2600.7)
RS485_EN: 12_GPIO_I2S0_PDM_SPDIF (U6.N3), 80_TY_Zigbee (R8008.1), 26_RS485 (R2604.1)
RTL8723DS_CMD: 11_SDIO_SDMMC (U6.C16), 60_WIFI_RTL8723DS (U6000.32)
RTL8723DS_D0: 11_SDIO_SDMMC (U6.B17), 60_WIFI_RTL8723DS (U6000.30)
RTL8723DS_D1: 11_SDIO_SDMMC (U6.A17), 60_WIFI_RTL8723DS (U6000.29)
RTL8723DS_D2: 11_SDIO_SDMMC (U6.B15), 60_WIFI_RTL8723DS (U6000.34)
RTL8723DS_D3: 11_SDIO_SDMMC (U6.A15), 60_WIFI_RTL8723DS (U6000.33)
SDIO_CLK: 11_SDIO_SDMMC (U6.B16), 60_WIFI_RTL8723DS (U6000.31)
SPI2_RX/UART2_RX_M0: 10_LCDC_MAC_I2S1_JTAG (U6.W9), 25_USB_OTG (R2506.1)
SPI2_TX/UART2_TX_M0: 10_LCDC_MAC_I2S1_JTAG (U6.T9), 25_USB_OTG (R2507.1)
SPK_MUTE: 12_GPIO_I2S0_PDM_SPDIF (U6.R4), 18_AUDIO_PowerAmp-AnalogT (R1812.1)
STK_INT: 12_GPIO_I2S0_PDM_SPDIF (U6.U3), 93 (J9301.4 R9306.1)
TP_INT: 12_GPIO_I2S0_PDM_SPDIF (U6.T3), 52_MIPI_Panel (J5201.25 TP5210.1)
TP_RST: 12_GPIO_I2S0_PDM_SPDIF (U6.T4), 52_MIPI_Panel (J5201.28 TP5213.1)
UART4_CTS: 11_SDIO_SDMMC (U6.K19), 60_WIFI_RTL8723DS (R6003.2)
UART4_RTS: 11_SDIO_SDMMC (U6.K18), 60_WIFI_RTL8723DS (R6008.1 U6000.26)
UART4_RXD: 11_SDIO_SDMMC (U6.F17), 60_WIFI_RTL8723DS (U6000.27), 26_RS485 (R2601.1)
UART4_TXD: 11_SDIO_SDMMC (U6.J16), 60_WIFI_RTL8723DS (U6000.25), 26_RS485 (R2603.1)
WIFI_REG_ON: 11_SDIO_SDMMC (U6.B14), 60_WIFI_RTL8723DS (R6005.1 U6000.4)
WIFI_WAKE_HOST: 12_GPIO_I2S0_PDM_SPDIF (U6.T17), 60_WIFI_RTL8723DS (U6000.20)
ZS_RST: 12_GPIO_I2S0_PDM_SPDIF (U6.P3), 80_TY_Zigbee (R8005.1 R8006.2)